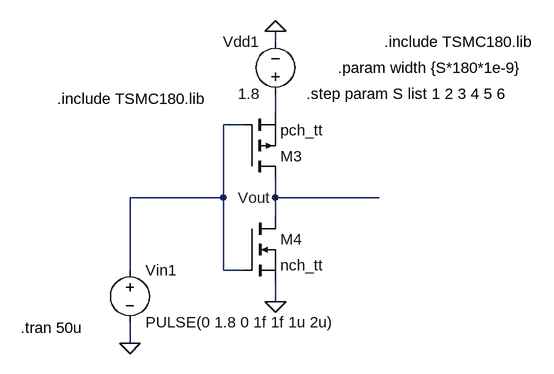
[diagram p0: schematic Q2.asc]
Q2.asc, the LTspice schematic file:
Version 4
SHEET 1 880 680
WIRE -288 -208 -288 -224
WIRE -288 -96 -288 -128
WIRE -336 -80 -368 -80
WIRE -368 32 -368 -80
WIRE -368 32 -512 32
WIRE -288 32 -288 0
WIRE -128 32 -288 32
WIRE -288 64 -288 32
WIRE -512 144 -512 32
WIRE -368 144 -368 32
WIRE -336 144 -368 144
WIRE -288 192 -288 160
WIRE -512 256 -512 224
FLAG -288 192 0
FLAG -288 -224 0
FLAG -512 256 0
FLAG -288 32 Vout
SYMBOL pmos -336 0 M180
SYMATTR InstName M3
SYMATTR Value pch_tt
SYMATTR Value2 w={5.27*width} l=180n
SYMBOL nmos -336 64 R0
SYMATTR InstName M4
SYMATTR Value nch_tt
SYMATTR Value2 w={width} l=180n
SYMBOL voltage -288 -112 R180
WINDOW 0 24 96 Left 2
WINDOW 3 24 16 Left 2
WINDOW 123 0 0 Left 0
WINDOW 39 0 0 Left 0
SYMATTR InstName Vdd1
SYMATTR Value 1.8
SYMBOL voltage -512 128 R0
WINDOW 123 0 0 Left 0
WINDOW 39 0 0 Left 0
SYMATTR InstName Vin1
SYMATTR Value PULSE(0 1.8 0 1f 1f 1u 2u)
TEXT -624 -120 Left 2 !.include TSMC180.lib
TEXT -680 232 Left 2 !.tran 50u
TEXT -120 -208 Left 2 !.include TSMC180.lib
TEXT -192 -168 Left 2 !.param width {S*180*1e-9}
TEXT -240 -128 Left 2 !.step param S list 1 2 3 4 5 6

The netlist it stands for:
* Q2.asc
M3 Vout N002 N001 N001 pch_tt w={5.27*width} l=180n
M4 Vout N002 0 0 nch_tt w={width} l=180n
Vdd1 N001 0 1.8
Vin1 N002 0 PULSE(0 1.8 0 1f 1f 1u 2u)
.model NMOS NMOS
.model PMOS PMOS
.lib standard.mos
.include TSMC180.lib
.tran 50u
.include TSMC180.lib
.param width {S*180*1e-9}
.step param S list 1 2 3 4 5 6
.backanno
.end